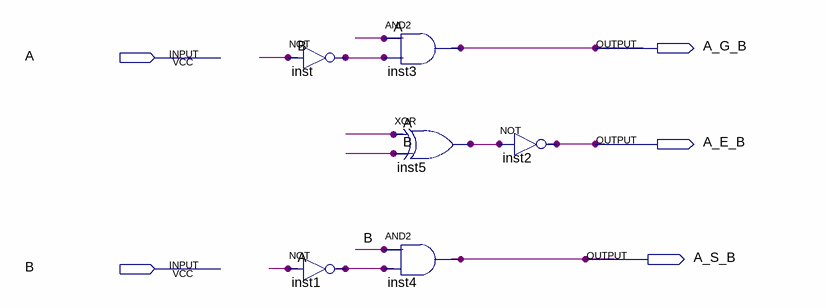
[diagram p0: schematic sheet]
// Quartus schematic compare_block1.bdf as structural Verilog: 6 symbols, 5 pins
module compare_block1 (
  input  A,
  input  B,
  output A_G_B,
  output A_E_B,
  output A_S_B
);

  wire inst1_out, inst5_out, inst_out;

  not inst (inst_out, B);
  not inst1 (inst1_out, A);
  and inst3 (A_G_B, A, inst_out);
  and inst4 (A_S_B, B, inst1_out);
  xor inst5 (inst5_out, A, B);
  not inst2 (A_E_B, inst5_out);
endmodule
